# EAGLE design power (EAGLE 7.0.0)
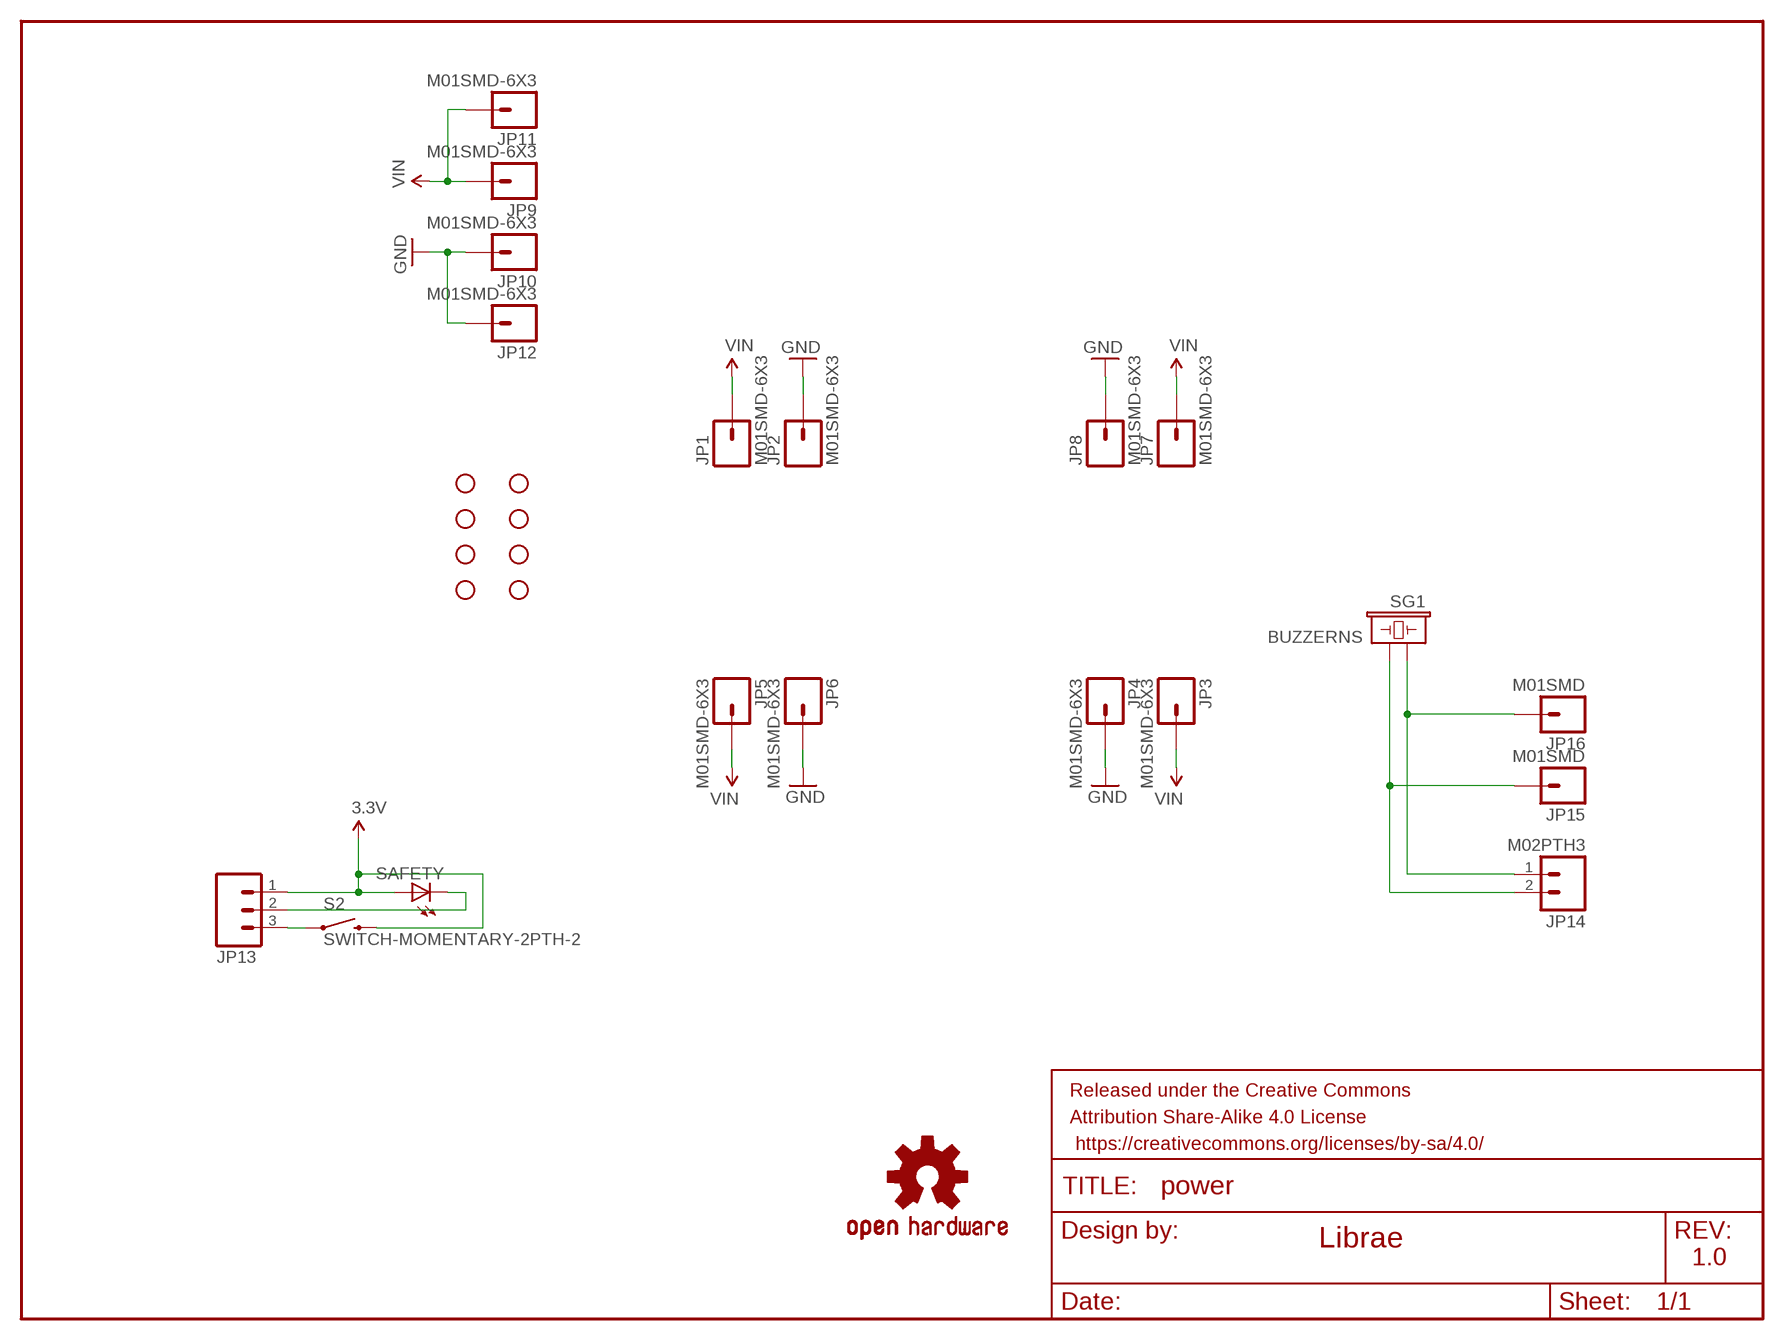
[diagram p0: schematic, sheet 1]

## Parts
FRAME1  FRAME-LETTER  [CREATIVE_COMMONS]
JP1  M01SMD-6X3  [PAD-BULLET]
JP2  M01SMD-6X3  [PAD-BULLET]
JP3  M01SMD-6X3  [PAD-BULLET]
JP4  M01SMD-6X3  [PAD-BULLET]
JP5  M01SMD-6X3  [PAD-BULLET]
JP6  M01SMD-6X3  [PAD-BULLET]
JP7  M01SMD-6X3  [PAD-BULLET]
JP8  M01SMD-6X3  [PAD-BULLET]
JP9  M01SMD-6X3  [PAD-BULLET]
JP10  M01SMD-6X3  [PAD-BULLET]
JP11  M01SMD-6X3  [PAD-BULLET]
JP12  M01SMD-6X3  [PAD-BULLET]
JP13  M03LONGPADS  [1X03_LONGPADS]
JP14  M02PTH3  [1X02_LONGPADS]
JP15  M01SMD  [LUXEON-PAD]
JP16  M01SMD  [LUXEON-PAD]
LOGO1  OSHW-LOGOL  [OSHW-LOGO-L]
S2  SWITCH-MOMENTARY-2PTH-2  [TACTILE-PTH-2]
SAFETY  LED5MM  [LED5MM]
SG1  BUZZERNS  [BUZZER-12MM-NS]
STANDOFF1  STAND-OFF  [STAND-OFF]
STANDOFF2  STAND-OFF  [STAND-OFF]
STANDOFF3  STAND-OFF  [STAND-OFF]
STANDOFF4  STAND-OFF  [STAND-OFF]
STANDOFF5  STAND-OFF  [STAND-OFF]
STANDOFF6  STAND-OFF  [STAND-OFF]
STANDOFF7  STAND-OFF  [STAND-OFF]
STANDOFF8  STAND-OFF  [STAND-OFF]

## Nets
3.3V: JP13.1 S2.4 SAFETY.A
GND: JP2.P$1 JP4.P$1 JP6.P$1 JP8.P$1 JP10.P$1 JP12.P$1
N$3: JP14.1 JP16.P$1 SG1.+
N$4: JP13.3 S2.1
N$5: JP13.2 SAFETY.K(C)
N$6: JP14.2 JP15.P$1 SG1.-
VIN: JP1.P$1 JP3.P$1 JP5.P$1 JP7.P$1 JP9.P$1 JP11.P$1

## Notes on the sheet
- Librae
- 1.0

## Library data of the parts
FRAME1 = SparkFun-Aesthetics:FRAME-LETTER: Schematic Frame Standard 8.5x11 US Letter frame
JP1-JP12 JP15 JP16 = SparkFun-Connectors-modified:M01: Header 1 Standard 1-pin 0.1" header. Use with straight break away headers (SKU : PRT-00116), right angle break away headers (PRT-00553), swiss pins (PRT-00743), machine pins (PRT-00117), and female headers (PRT-00115).
JP13 = SparkFun-Connectors:M03: Header 3 Standard 3-pin 0.1" header. Use with straight break away headers (SKU : PRT-00116), right angle break away headers (PRT-00553), swiss pins (PRT-00743), machine pins (PRT-00117), and female headers (PRT-00115). Molex polarized connector foot print use with SKU : PRT-08232 with associated crimp pins and housings.
JP14 = SparkFun-Connectors:M02: Standard 2-pin 0.1" header. Use with - straight break away headers ( PRT-00116) - right angle break away headers (PRT-00553) - swiss pins (PRT-00743) - machine pins (PRT-00117) - female headers (PRT-00115) Molex polarized connector foot print use with: PRT-08233 with associated crimp pins and housings. 2.54_SCREWTERM for use with PRT-10571. 3.5mm Screw Terminal footprints for PRT-08084 5mm Screw Terminal footprints for use with PRT-08433
LOGO1 = SparkFun-Aesthetics:OSHW-LOGO: Open Source Hardware Logo This logo indicates the piece of hardware it is found on incorporates a OSHW license and/or adheres to the definition of open source hardware found here: http://freedomdefined.org/OSHW
S2 = SparkFun-Electromechanical:SWITCH-MOMENTARY-2: Various NO switches- pushbuttons, reed, etc
SAFETY = adafruit:LED: LED OSRAM: - CHIPLED LG R971, LG N971, LY N971, LG Q971, LY Q971, LO R971, LY R971 LH N974, LH R974 LS Q976, LO Q976, LY Q976 LO Q996 - Hyper CHIPLED LW Q18S LB Q993, LB Q99A, LB R99A - SideLED LS A670, LO A670, LY A670, LG A670, LP A670 LB A673, LV A673, LT A673, LW A673 LH A674 LY A675 LS A676, LA A676, LO A676, LY A676, LW A676 LS A679, LY A679, LG A679 - Hyper Micro SIDELED® LS Y876, LA Y876, LO Y876, LY Y876 LT Y87S - SmartLED LW L88C, LW L88S LB L89C, LB L89S, LG L890 LS L89K, LO L89K, LY L89K LS L896, LA L896, LO L896, LY L896 - TOPLED LS T670, LO T670, LY T670, LG T670, LP T670 LSG T670, LSP T670, LSY T670, LOP T670, LYG T670 LG T671, LOG T671, LSG T671 LB T673, LV T673, LT T673, LW T673 LH T674 LS T676, LA T676, LO T676, LY T676, LB T676, LH T676, LSB T676, LW T676 LB T67C, LV T67C, LT T67C, LS T67K, LO T67K, LY T67K, LW E67C LS E67B, LA E67B, LO E67B, LY E67B, LB E67C, LV E67C, LT E67C LW T67C LS T679, LY T679, LG T679 LS T770, LO T770, LY T770, LG T770, LP T770 LB T773, LV T773, LT T773, LW T773 LH T774 LS E675, LA E675, LY E675, LS T675 LS T776, LA T776, LO T776, LY T776, LB T776 LHGB T686 LT T68C, LB T68C - Hyper Mini TOPLED® LB M676 - Mini TOPLED Santana® LG M470 LS M47K, LO M47K, LY M47K Source: http://www.osram.convergy.de/
SG1 = SparkFun-Electromechanical:BUZZER: Buzzer 12mm Spark Fun Electronics SKU : Comp-Buzzer
STANDOFF1-STANDOFF8 = SparkFun-Electromechanical:STAND-OFF: #4 Stand Off This is the mechanical footprint for a #4 phillips button head screw. Use the keepout ring to avoid running the screw head into surrounding components. SKU : PRT-00447

## Net classes
0 default: clearance 0.205 mm

## Board
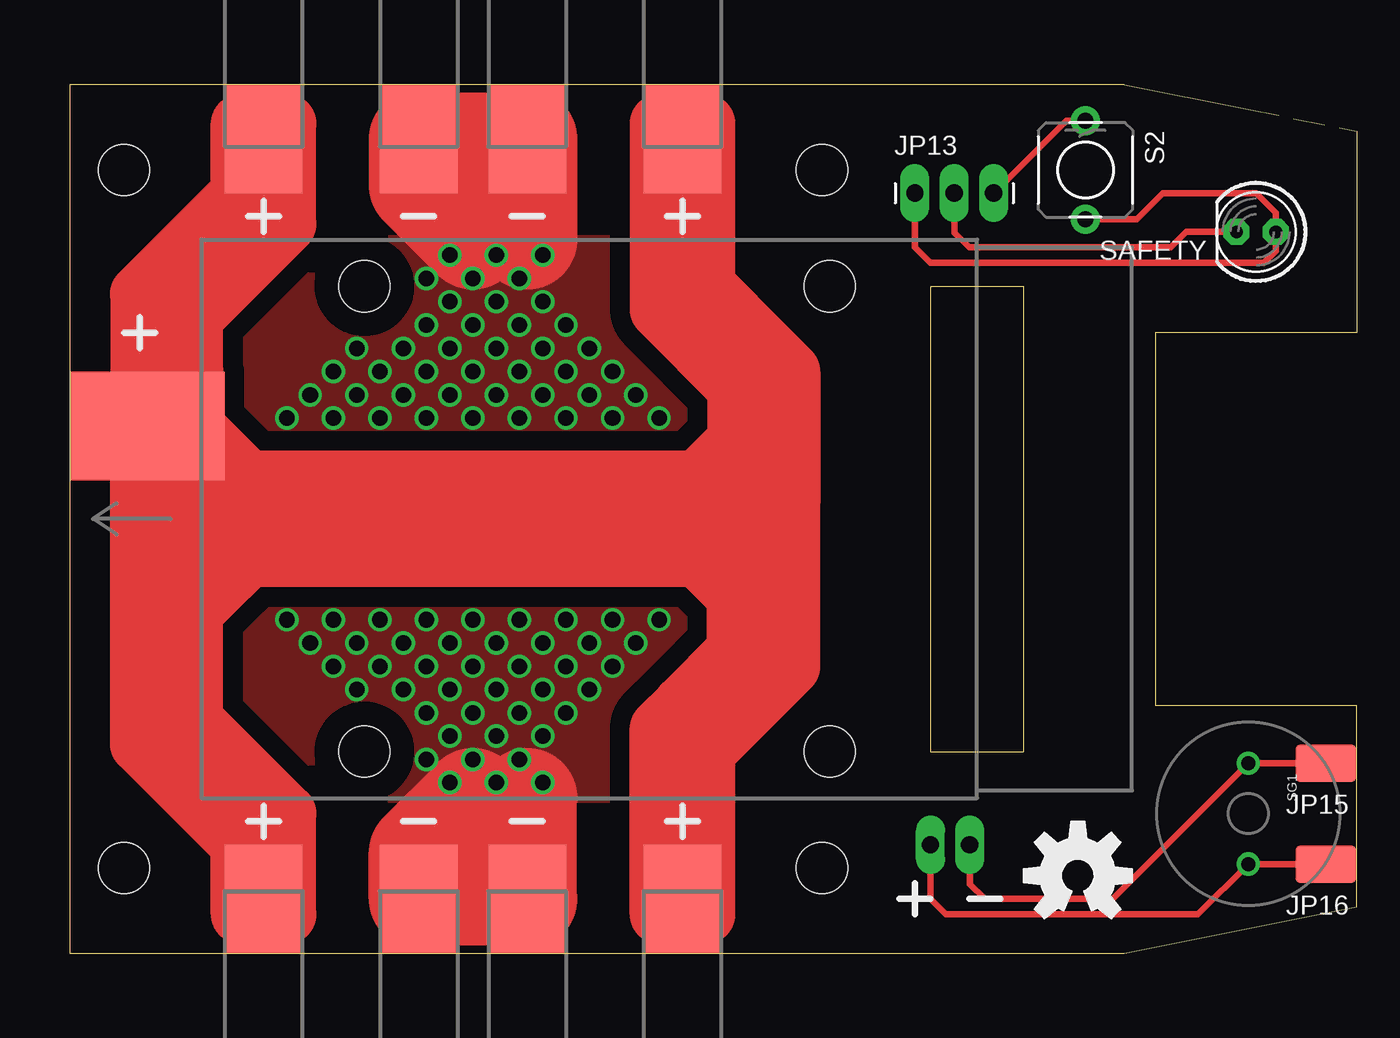
[diagram p1: board, top side]
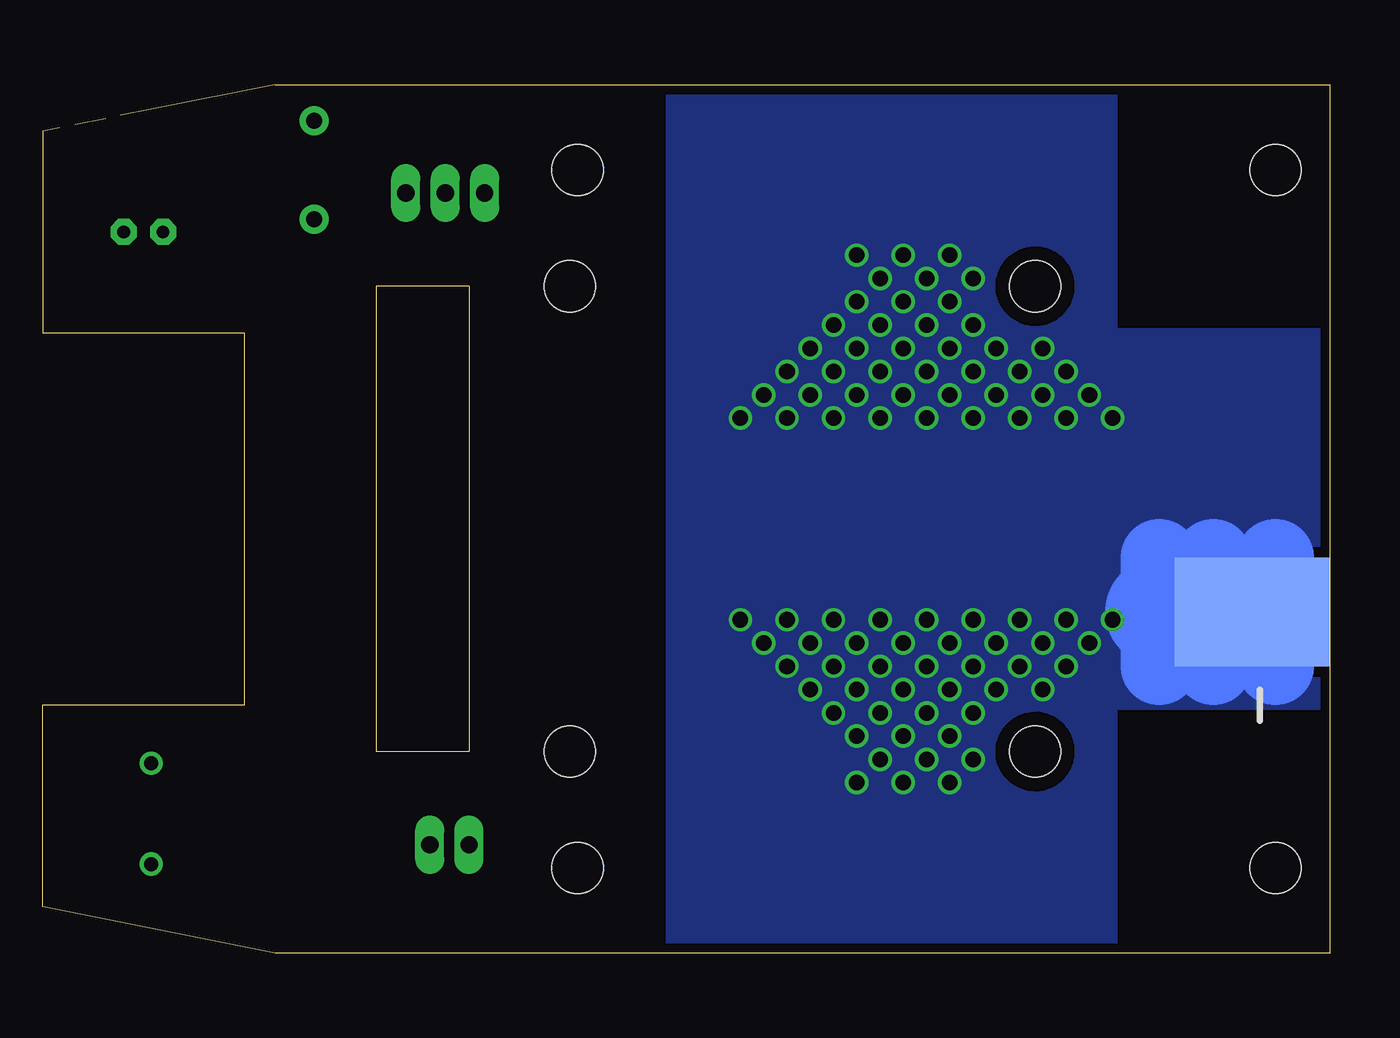
[diagram p2: board, bottom side, seen from below]

Size 83 x 56 mm. Coordinates in mm from the lower left corner, seen from the top.
Outline: 0,0 68,0 83,3 83,16 70,16 70,40 83,40 83,53 76,54.4 68,56 0,56 0,0
Outline: 55.5,43 55.5,13 61.5,13 61.5,43 55.5,43
Copper layers (1*16): Top 0.035mm / dielectric 1.5mm / Bottom 0.035mm
Design rules "SparkFun-2-layer": minimum track width 7mil, minimum drill 15mil, track to track 8mil, track to pad 8mil, pad to pad 8mil, via to via 8mil, smd to smd 8mil, copper to edge 8mil, drill to drill 8mil, minimum pad ring 12mil, minimum via ring 10mil, stop-mask expansion 4mil, vias tented up to drill 20mil, thermal gap 10mil

### Footprints (pad centres in the part's own frame; a part is rotated, then mirrored left to right if it is on the bottom)
PAD-BULLET = smd 7 x 5: P$1 0,0
1X03_LONGPADS = drill 1.118 pad 1.88 long: 1 0,0; 2 2.54,0; 3 5.08,0
1X02_LONGPADS = drill 1.118 pad 1.88 long: 1 0,0; 2 2.54,0
LUXEON-PAD = smd 3.9 x 2.4: P$1 0,0
TACTILE-PTH-2 = drill 1.016 pad 1.88: 1 -3.175,0; 4 3.175,0
LED5MM = drill 0.813 pad 1.676 octagon: A -1.27,0; K 1.27,0
BUZZER-12MM-NS = drill 0.9: + 3.25,0; - -3.25,0
STAND-OFF = hole 3.302: 0,0

### Placement (x,y rotation side)
FRAME1  22,-21 0 top  (outside the outline)
JP1  12.5,52.5 270 top
JP2  22.5,52.5 90 top
JP3  39.5,3.5 90 top
JP4  29.5,3.5 90 top
JP5  12.5,3.5 90 top
JP6  22.5,3.5 90 top
JP7  39.5,52.5 90 top
JP8  29.5,52.5 90 top
JP9  2.5,34 90 top
JP10  2.5,22 270 bottom
JP11  7.5,34 270 top
JP12  7.5,22 90 bottom
JP13  54.5,49 0 top
JP14  55.5,7 0 top
JP15  81,12.25 180 top
JP16  81,5.75 180 top
LOGO1  65,5 0 top
S2  65.5,50.5 270 top
SAFETY  76.5,46.5 180 top
SG1  76,9 270 top
STANDOFF1  3.5,50.5 0 top
STANDOFF2  48.5,5.5 0 top
STANDOFF3  3.5,5.5 0 top
STANDOFF4  48.5,50.5 0 top
STANDOFF5  19,43 0 top
STANDOFF6  49,13 0 top
STANDOFF7  19,13 0 top
STANDOFF8  49,43 0 top

### Tracks (layer width: path | path; a pad name or v marks a point on that pad's centre or on a via)
3.3V
  Top 0.406: JP13.1 54.5,45.5 55.5,44.5 77,44.5 77.77,45.27 SAFETY.A 77.77,47.73 76.5,49 70.5,49 68.83,47.33 S2.4
GND  (via drill 1)
  Top 5: JP6.P$1 23,3.5 | 28.5,3.5 JP4.P$1 | JP2.P$1 23,52.5 | 29,52.5 JP8.P$1
  Top 6: 23,3.5 28.5,3.5 | 23,52.5 29,52.5
  Top 6.452: JP4.P$1 29.5,10 | JP6.P$1 22.5,6.5 26,10 | JP8.P$1 29.5,46 | JP2.P$1 22.5,49.5 26,46
  Bottom 0.406: 5,22 JP10.P$1 3.5,22 3.5,24
  Bottom 5: 3.5,25.5 3.5,24 3.5,18.5 | 7.5,25.5 JP12.P$1 7.5,18.5 | 11,25.5 11,22 11,18.5
  Bottom 7: 5,22 JP12.P$1 11,22
  other vias: 17,21.5 20,21.5 23,21.5 26,21.5 29,21.5 32,21.5 35,21.5 18.5,20 21.5,20 24.5,20 27.5,20 30.5,20 33.5,20 20,18.5 23,18.5 26,18.5 29,18.5 32,18.5 21.5,17 24.5,17 27.5,17 30.5,17 23,15.5 26,15.5 29,15.5 32,15.5 24.5,14 27.5,14 30.5,14 35,18.5 26,12.5 29,12.5 35,34.5 32,34.5 29,34.5 26,34.5 23,34.5 20,34.5 17,34.5 33.5,36 30.5,36 27.5,36 24.5,36 21.5,36 18.5,36 32,37.5 29,37.5 26,37.5 23,37.5 20,37.5 30.5,39 27.5,39 24.5,39 21.5,39 29,40.5 26,40.5 23,40.5 30.5,42 27.5,42 24.5,42 35,37.5 29,43.5 26,43.5 32,40.5 33.5,17 24.5,11 27.5,11 30.5,11 33.5,39 24.5,45 27.5,45 30.5,45 36.5,20 38,21.5 38,34.5 36.5,36 17,18.5 18.5,17 15.5,20 14,21.5 18.5,39 17,37.5 15.5,36 14,34.5 23,43.5 23,12.5
  pour Bottom (isolate 0.61): 14,56 42.5,56 42.5,0 14,0 14,16 0,16 0,17.5 11,17.5 11,26.5 0,26.5 0,40 14,40
  pour Top (isolate 1.27): 0,56 0,0 16.5,0 16.5,10 35.5,10 35.5,0 52,0 52,56 35.5,56 35.5,46 16.5,46 16.5,56
N$1
  Top 3.81: 41,13 41,2.5
N$2
  Top 3.81: 41,53.5 41,43.5
N$3
  Top 0.406: JP14.1 55.5,3.5 56.5,2.5 72.75,2.5 SG1.+ JP16.P$1
N$4
  Top 0.406: JP13.3 64.25,53.67 S2.1
N$5
  Top 0.406: JP13.2 57.04,46.46 58,45.5 71,45.5 72,46.5 SAFETY.K
N$6
  Top 0.406: JP14.2 58.04,4.46 59,3.5 67.25,3.5 SG1.- JP15.P$1
VIN
  Top 0.254: 46.5,28.5 46.5,29 | JP11.P$1 8,34 | 11,2.5 12.5,2.5 12.5,4 | 13,52 13,53.5 12.5,53.5 11,53.5
  Top 0.406: 4,34 4,34.5 | 38.5,27.5 40,27.5 40,30 | JP7.P$1 38,52.5 38,53
  Top 3.81: 3.25,33.25 4.5,32 4.5,13.5 12.5,5.5 | 3.25,33.25 JP9.P$1 | 8,22 8,15 14,9 14,2.5 12.5,5.5 | 8,22 8,33.5 JP11.P$1 | 4.5,34 4.5,42.5 12.5,50.5 JP1.P$1 12.5,53.5 | 4.5,34 3.75,33.25 3.25,33.25 | 4.5,34 4,34 | 12.5,3 JP5.P$1 12.5,4 12.5,5.5 | 39.5,11.5 39.5,16 | 39.5,44.5 46.5,37.5 46.5,30.5 | 46.5,30.5 46.5,29 | JP3.P$1 39.5,11.5 | 39.5,11.5 46.5,18.5 46.5,25.5 | 46.5,25.5 46.5,28.5 46,28 10.5,28 | 10.5,28 4.5,34 | 4.5,34 4,34.5 | 10.5,28 5,28 | 46.5,30.5 6,30.5 | 46.5,25.5 6,25.5 | 4.5,34 8,37.5 8,41 14,47 14,53.5 | 11,48.5 11,53.5 | 11,2.5 11,7.5 | 39.5,16 43,19.5 43,23.5 42.5,23.5 38.5,27.5 | 40,30 43,33 43,36.5 38,41.5 38,53 38,53.5 | 38,2.5 38,14.5 39.5,16 | 8,22 12.5,26.5 | 7.5,35.5 7.5,34.5 8,34 11,31

### Text on the board
tDocu: Librae